# EAGLE design VSCard (EAGLE 8.3.1)
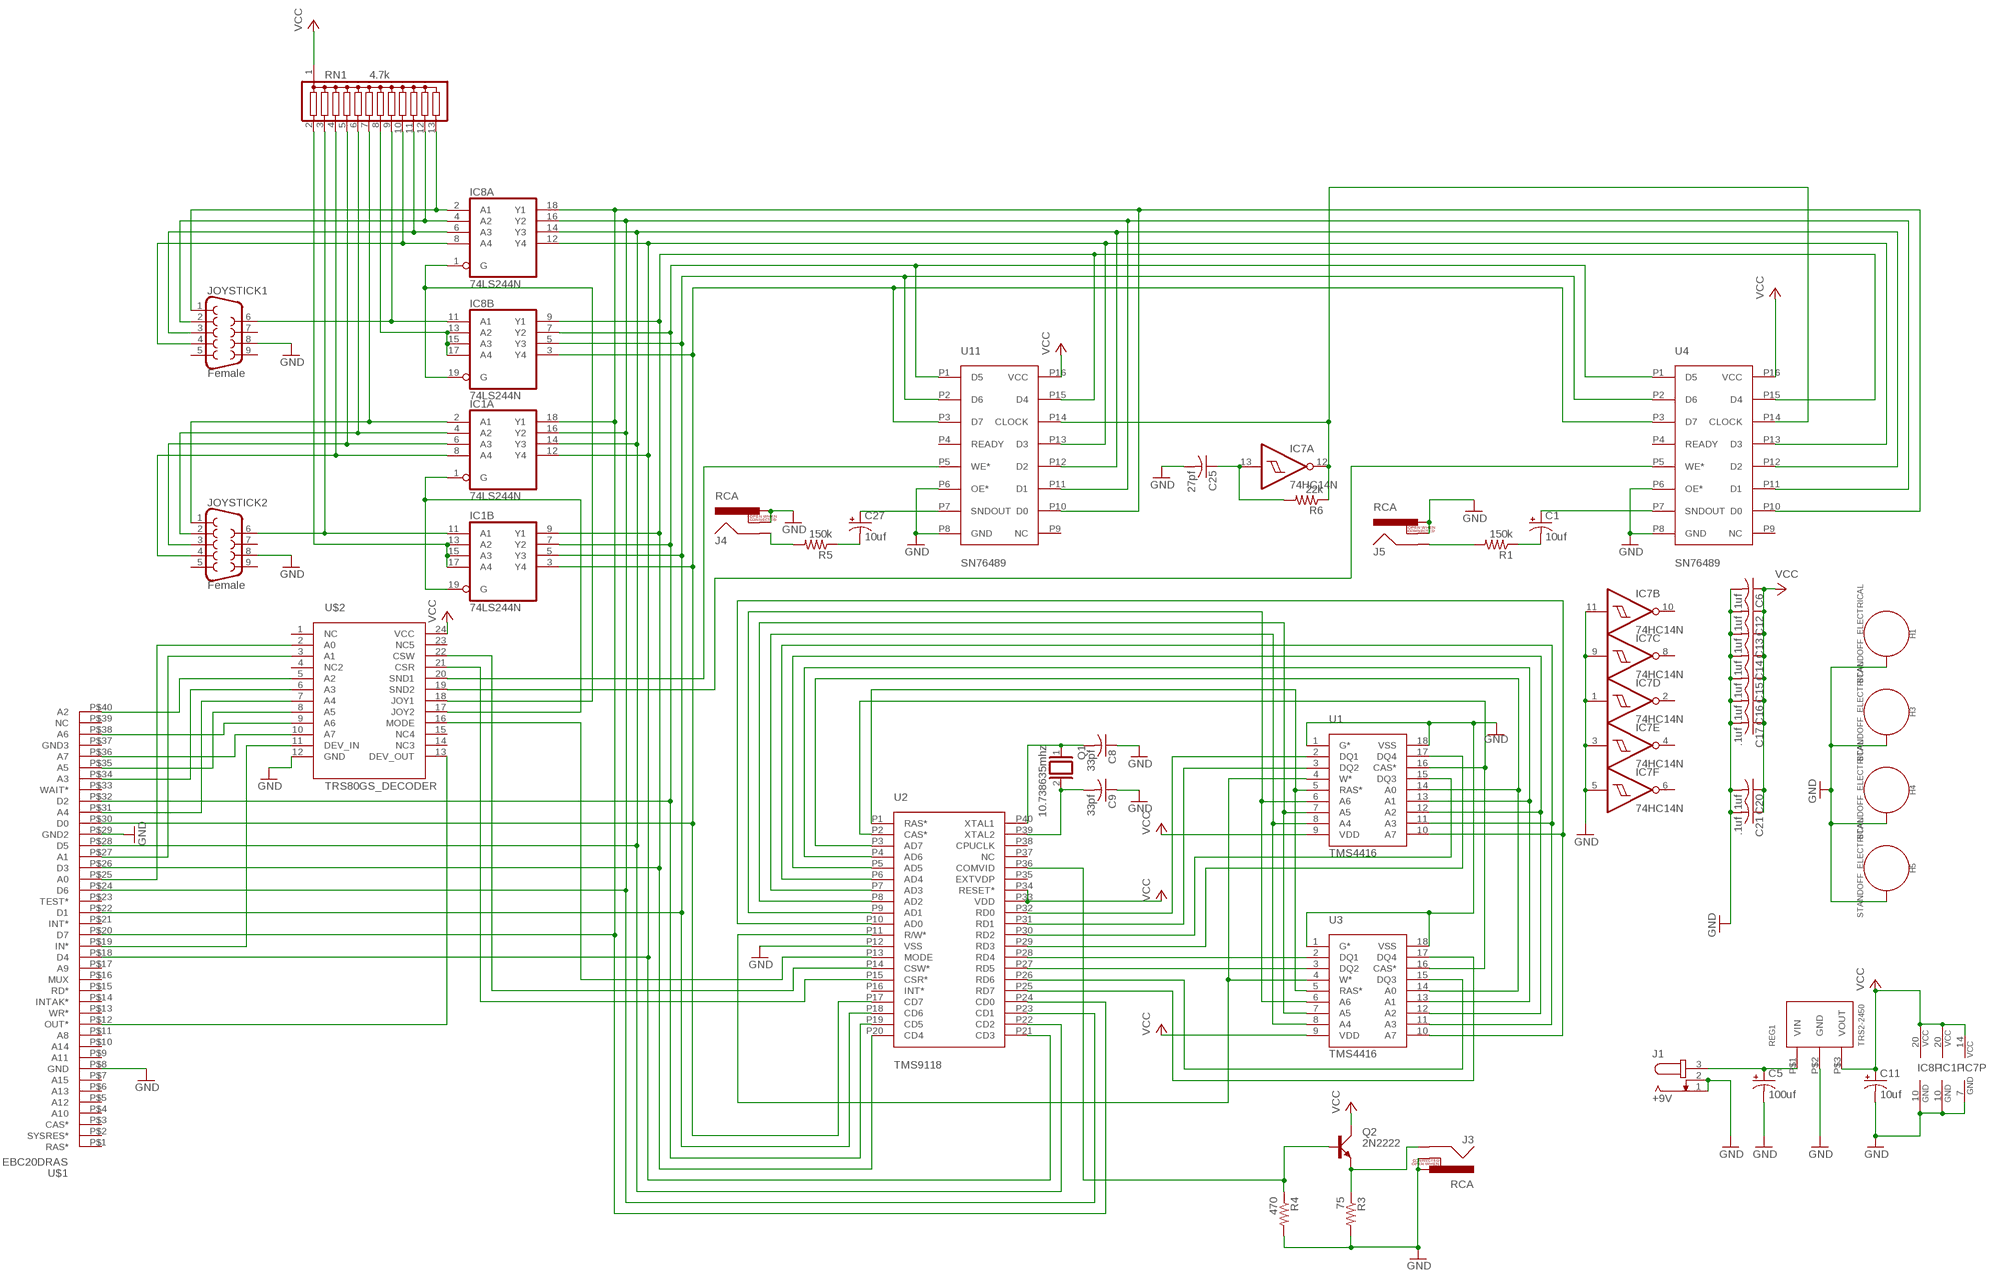
[diagram p0: schematic, sheet 1]

## Parts
C1  10uf  CPOL-USE2.5-6  [E2,5-6]
C5  100uf  CPOL-USE3.5-10  [E3,5-10]
C6  .1uf  C-US025-025X050  [C025-025X050]
C8  33pf  C-US050-050X075  [C050-050X075]
C9  33pf  C-US050-050X075  [C050-050X075]
C11  10uf  CPOL-USE3.5-10  [E3,5-10]
C12  .1uf  C-US025-025X050  [C025-025X050]
C13  .1uf  C-US025-025X050  [C025-025X050]
C14  .1uf  C-US025-025X050  [C025-025X050]
C15  .1uf  C-US025-025X050  [C025-025X050]
C16  .1uf  C-US025-025X050  [C025-025X050]
C17  .1uf  C-US025-025X050  [C025-025X050]
C20  .1uf  C-US025-025X050  [C025-025X050]
C21  .1uf  C-US025-025X050  [C025-025X050]
C25  27pf  C-US025-025X050  [C025-025X050]
C27  10uf  CPOL-USE2.5-6  [E2,5-6]
H1  STANDOFF_ELECTRICAL  [STANDOFF-ELECTRICAL]
H3  STANDOFF_ELECTRICAL  [STANDOFF-ELECTRICAL]
H4  STANDOFF_ELECTRICAL  [STANDOFF-ELECTRICAL]
H5  STANDOFF_ELECTRICAL  [STANDOFF-ELECTRICAL]
IC1  74LS244N  [DIL20]
IC7  74HC14N  [DIL14]
IC8  74LS244N  [DIL20]
J1  +9V  JACK-PLUG0  [SPC4077]
J3  RCA  [RCA]
J4  RCA  [RCA]
J5  RCA  [RCA]
JOYSTICK1  Female  DB9FEMALE  [DB9]
JOYSTICK2  Female  DB9FEMALE  [DB9]
Q1  10.738635mhz  XTAL/S  [QS]
Q2  2N2222  [TO18A]
R1  150k  R-US_0207/2V  [0207/2V]
R3  75  R-US_0207/2V  [0207/2V]
R4  470  R-US_0207/2V  [0207/2V]
R5  150k  R-US_0207/2V  [0207/2V]
R6  22k  R-US_0207/2V  [0207/2V]
REG1  TRS2-2450  [TRACON_REG]
RN1  4.7k  G12R  [SIL13]
U1  TMS4416  [DIP18]
U2  TMS9118  [DIP40_MCU]
U3  TMS4416  [DIP18]
U4  SN76489  [DIP16]
U11  SN76489  [DIP16]
U$1  EBC20DRAS  [EBC20DRAS]
U$2  TRS80GS_DECODER  [DIP24SKI]

## Nets
COMVID: Q2.B R4.1 U2.P36(COMVID)
COMVID-OUT: J3.SHELL Q2.E R3.1
D0: IC1.3(B:Y4) IC8.3(B:Y4) U2.P17(CD7) U4.P3(D7) U11.P3(D7) U$1.P$30(D0)
D1: IC1.5(B:Y3) IC8.5(B:Y3) U2.P18(CD6) U4.P2(D6) U11.P2(D6) U$1.P$22(D1)
D2: IC1.7(B:Y2) IC8.7(B:Y2) U2.P19(CD5) U4.P1(D5) U11.P1(D5) U$1.P$32(D2)
D3: IC1.9(B:Y1) IC8.9(B:Y1) U2.P20(CD4) U4.P15(D4) U11.P15(D4) U$1.P$26(D3)
D4: IC1.12(A:Y4) IC8.12(A:Y4) U2.P21(CD3) U4.P13(D3) U11.P13(D3) U$1.P$18(D4)
D5: IC1.14(A:Y3) IC8.14(A:Y3) U2.P22(CD2) U4.P12(D2) U11.P12(D2) U$1.P$28(D5)
D6: IC1.16(A:Y2) IC8.16(A:Y2) U2.P23(CD1) U4.P11(D1) U11.P11(D1) U$1.P$24(D6)
D7: IC1.18(A:Y1) IC8.18(A:Y1) U2.P24(CD0) U4.P10(D0) U11.P10(D0) U$1.P$20(D7)
DOWN: IC8.4(A:A2) JOYSTICK1.2 RN1.12
DOWN1: IC1.4(A:A2) JOYSTICK2.2 RN1.6
GND: C5.- C6.2 C8.1 C9.1 C11.- C12.2 C13.2 C14.2 C15.2 C16.2 C17.2 C20.2 C21.2 C25.2 H1.P1 H3.P1 H4.P1 H5.P1 IC1.10(P:GND) IC7.1(D:I) IC7.3(E:I) IC7.5(F:I) IC7.7(P:GND) IC7.9(C:I) IC7.11(B:I) IC8.10(P:GND) J1.1 J1.2 J3.PIN J3.SWITCH J4.PIN J4.SWITCH J5.PIN J5.SWITCH JOYSTICK1.8 JOYSTICK2.8 R3.2 R4.2 REG1.P$2(GND) U1.1(G*) U1.18(VSS) U2.P12(VSS) U3.1(G*) U3.18(VSS) U4.P6(OE*) U4.P8(GND) U11.P6(OE*) U11.P8(GND) U$1.P$8(GND) U$1.P$29(GND2) U$2.12(GND)
JOY1_IN_ENABLE_N: IC8.1(A:G) IC8.19(B:G) U$2.18(JOY1)
JOY1_IN_ENABLE_N1: IC1.1(A:G) IC1.19(B:G) U$2.17(JOY2)
LEFT: IC8.6(A:A3) JOYSTICK1.3 RN1.11
LEFT1: IC1.6(A:A3) JOYSTICK2.3 RN1.5
N$1: J4.SHELL R5.2
N$2: U$1.P$25(A0) U$2.2(A0)
N$3: U$1.P$27(A1) U$2.3(A1)
N$4: U$1.P$40(A2) U$2.5(A2)
N$5: U$1.P$34(A3) U$2.6(A3)
N$6: U$1.P$31(A4) U$2.7(A4)
N$7: U$1.P$35(A5) U$2.8(A5)
N$8: U$1.P$38(A6) U$2.9(A6)
N$9: U$1.P$36(A7) U$2.10(A7)
N$10: U$1.P$19(IN*) U$2.11(DEV_IN)
N$11: IC1.13(B:A2) IC1.15(B:A3) IC1.17(B:A4) RN1.2
N$12: U$1.P$12(OUT*) U$2.13(DEV_OUT)
N$13: U2.P13(MODE) U$2.16(MODE)
N$14: U2.P14(CSW*) U$2.22(CSW)
N$15: U2.P15(CSR*) U$2.21(CSR)
N$18: U1.5(RAS*) U2.P1(RAS*) U3.5(RAS*)
N$20: U11.P5(WE*) U$2.20(SND1)
N$21: U1.16(CAS*) U2.P2(CAS*) U3.16(CAS*)
N$22: U4.P5(WE*) U$2.19(SND2)
N$64: C27.- R5.1
N$88: C25.1 IC7.13(A:I) R6.2
N$94: C1.- R1.1
N$95: J5.SHELL R1.2
N$99: IC8.13(B:A2) IC8.15(B:A3) IC8.17(B:A4) RN1.8
RIGHT: IC8.8(A:A4) JOYSTICK1.4 RN1.10
RIGHT1: IC1.8(A:A4) JOYSTICK2.4 RN1.4
SN76489-CLOCK: IC7.12(A:O) R6.1 U4.P14(CLOCK) U11.P14(CLOCK)
SNDOUT1: C27.+ U11.P7(SNDOUT)
SNDOUT2: C1.+ U4.P7(SNDOUT)
TMS9118_RW(*)_TMS4416_W(*): U1.4(W*) U2.P11(R/W*) U3.4(W*)
TMS9918_AD0-TMS4416_A7: U1.10(A7) U2.P10(AD0) U3.10(A7)
TMS9918_AD1-TMS4416_A6: U1.6(A6) U2.P9(AD1) U3.6(A6)
TMS9918_AD2-TMS4416_A5: U1.7(A5) U2.P8(AD2) U3.7(A5)
TMS9918_AD3-TMS4416_A4: U1.8(A4) U2.P7(AD3) U3.8(A4)
TMS9918_AD4-TMS4416_A3: U1.11(A3) U2.P6(AD4) U3.11(A3)
TMS9918_AD5-TMS4416_A2: U1.12(A2) U2.P5(AD5) U3.12(A2)
TMS9918_AD6-TMS4416_A1: U1.13(A1) U2.P4(AD6) U3.13(A1)
TMS9918_AD7-TMS4416_A0: U1.14(A0) U2.P3(AD7) U3.14(A0)
TRIGGER: IC8.11(B:A1) JOYSTICK1.6 RN1.9
TRIGGER1: IC1.11(B:A1) JOYSTICK2.6 RN1.3
UP: IC8.2(A:A1) JOYSTICK1.1 RN1.13
UP1: IC1.2(A:A1) JOYSTICK2.1 RN1.7
VCC: C6.1 C11.+ C12.1 C13.1 C14.1 C15.1 C16.1 C17.1 C20.1 C21.1 IC1.20(P:VCC) IC7.14(P:VCC) IC8.20(P:VCC) Q2.C REG1.P$3(VOUT) RN1.1 U1.9(VDD) U2.P33(VDD) U2.P34(RESET*) U3.9(VDD) U4.P16(VCC) U11.P16(VCC) U$2.24(VCC)
VDP-RD0: U1.2(DQ1) U2.P32(RD0)
VDP-RD1: U1.3(DQ2) U2.P31(RD1)
VDP-RD2: U1.15(DQ3) U2.P30(RD2)
VDP-RD3: U1.17(DQ4) U2.P29(RD3)
VDP-RD4: U2.P28(RD4) U3.2(DQ1)
VDP-RD5: U2.P27(RD5) U3.3(DQ2)
VDP-RD6: U2.P26(RD6) U3.15(DQ3)
VDP-RD7: U2.P25(RD7) U3.17(DQ4)
VOLTAGE-IN: C5.+ J1.3 REG1.P$1(VIN)
XTAL1: C8.2 Q1.1 U2.P40(XTAL1)
XTAL2: C9.2 Q1.2 U2.P39(XTAL2)
Unconnected: IC7.2(D:O) IC7.4(E:O) IC7.6(F:O) IC7.8(C:O) IC7.10(B:O) JOYSTICK1.5 JOYSTICK1.7 JOYSTICK1.9 JOYSTICK2.5 JOYSTICK2.7 JOYSTICK2.9 U2.P16(INT*) U2.P35(EXTVDP) U2.P37(NC) U2.P38(CPUCLK) U4.P4(READY) U4.P9(NC) U11.P4(READY) U11.P9(NC) U$1.P$1(RAS*) U$1.P$2(SYSRES*) U$1.P$3(CAS*) U$1.P$4(A10) U$1.P$5(A12) U$1.P$6(A13) U$1.P$7(A15) U$1.P$9(A11) U$1.P$10(A14) U$1.P$11(A8) U$1.P$13(WR*) U$1.P$14(INTAK*) U$1.P$15(RD*) U$1.P$16(MUX) U$1.P$17(A9) U$1.P$21(INT*) U$1.P$23(TEST*) U$1.P$33(WAIT*) U$1.P$37(GND3) U$1.P$39(NC) U$2.1(NC) U$2.4(NC2) U$2.14(NC3) U$2.15(NC4) U$2.23(NC5)

## Library data of the parts
C1 C27 = resistor:CPOL-US: POLARIZED CAPACITOR, American symbol
C5 C11 = rcl:CPOL-US: POLARIZED CAPACITOR, American symbol
C6 C12-C17 C20 C21 C25 = resistor:C-US: CAPACITOR, American symbol
C8 C9 = rcl:C-US: CAPACITOR, American symbol
H1 H3-H5 = SparkFun-Hardware:STANDOFF_ELECTRICAL: Stand Off Drill holes with an electrical connection. For example, use these to ground your board to a chassis. Example SparkFun Products Screw - Phillips Head (1/4", 4-40, 10 pack) <https://www.sparkfun.com/products/10453> (PRT-10453) Screw - Phillips Head (1/2", 4-40, 10 pack) <https://www.sparkfun.com/products/10452> (PRT-10452) Screw - Phillips Head (3/4", 4-40, 10 pack) <https://www.sparkfun.com/products/10451> (PRT-10451) Screw - Phillips Head (1", 4-40, 10 pack) <https://www.sparkfun.com/products/10450> (PRT-10450)
IC1 IC8 = 74xx-us:74*244: Octal BUFFER and LINE DRIVER, 3-state
IC7 = 74xx-eu:74*14: Hex schmitt trigger INVERTER
J1 = con-jack:JACK-PLUG: DC POWER JACK Power Jack, DC, Right Angle, Through Hole, Rated 5A at 16VDC, PC Terminals Distributor: Farnell (www.Farnell.de) Drawing: 84N1161.pdf / 84N1162.pdf Manufacturer: SPC Technology (www.spctechnology.com) Type: SPC4077 / SPC 4078; OC_FARNELL: unknown; OC_NEWARK: unknown
J3-J5 = SparkFun-Connectors:RCA: RCA Jack connector This is a right angle RCA jack connecotr. Commonly used for video or audio. Here is the connector we sell at SparkFun: RCA Jack <https://www.sparkfun.com/products/8631> (PRT-08631) Datasheet <http://www.sparkfun.com/datasheets/Prototyping/Connectors/RCA-Jack.pdf> It is not used on any active designs, however it was used on a couple retired products: RCA Jack Breakout [RETIRED] <https://www.sparkfun.com/products/8826> (PRT-08826) SparkFun On Screen Display Breakout - MAX7456 [RETIRED] <https://www.sparkfun.com/products/9168> (BOB-09168) You may also be interested in a cable: RCA Video Cable - 6' <https://www.sparkfun.com/products/11573> (CAB-11573); PROD_ID: CONN-09081; SF_ID: PRT-08631
JOYSTICK1 JOYSTICK2 = SparkFun-Connectors:DB9: DB9 Connector Standard DB9 (D-Sub 9) serial connector. Can be used for CAN bus as well as RS485 and RS232. Footprint production proven. Here is the female version connector we sell at SparkFun: 9 Pin Female Serial Connector - PCB Mount <https://www.sparkfun.com/products/429> (PRT-00429) This connector has been used on the following SparkFun products: SparkFun RS232 Shifter - SMD <https://www.sparkfun.com/products/449> (PRT-00449) SparkFun RS232 Shifter SMD (No DB9) <https://www.sparkfun.com/products/8780> (PRT-08780); PROD_ID: CONN-08194
Q1 = special:XTAL/S: CRYSTAL
Q2 = transistor-small-signal:2N2222: NPN TRANSISTOR
R1 R3-R6 = resistor:R-US_: RESISTOR, American symbol
REG1 = TMS99:TRS2-2450: 5V TRACO regulator
RN1 = resistor-sil:G12R: SIL RESISTOR; OC_FARNELL: unknown; OC_NEWARK: unknown
U1 U3 = TMS99:TMS4416: TMS4416
U2 = TMS99:TMS9118: TMS9118
U4 U11 = TMS99:SN76489: SN76489 Sound Chip
U$1 = TMS99:EBC20DRAS
U$2 = TMS99:TRS80GS_DECODER

## Board
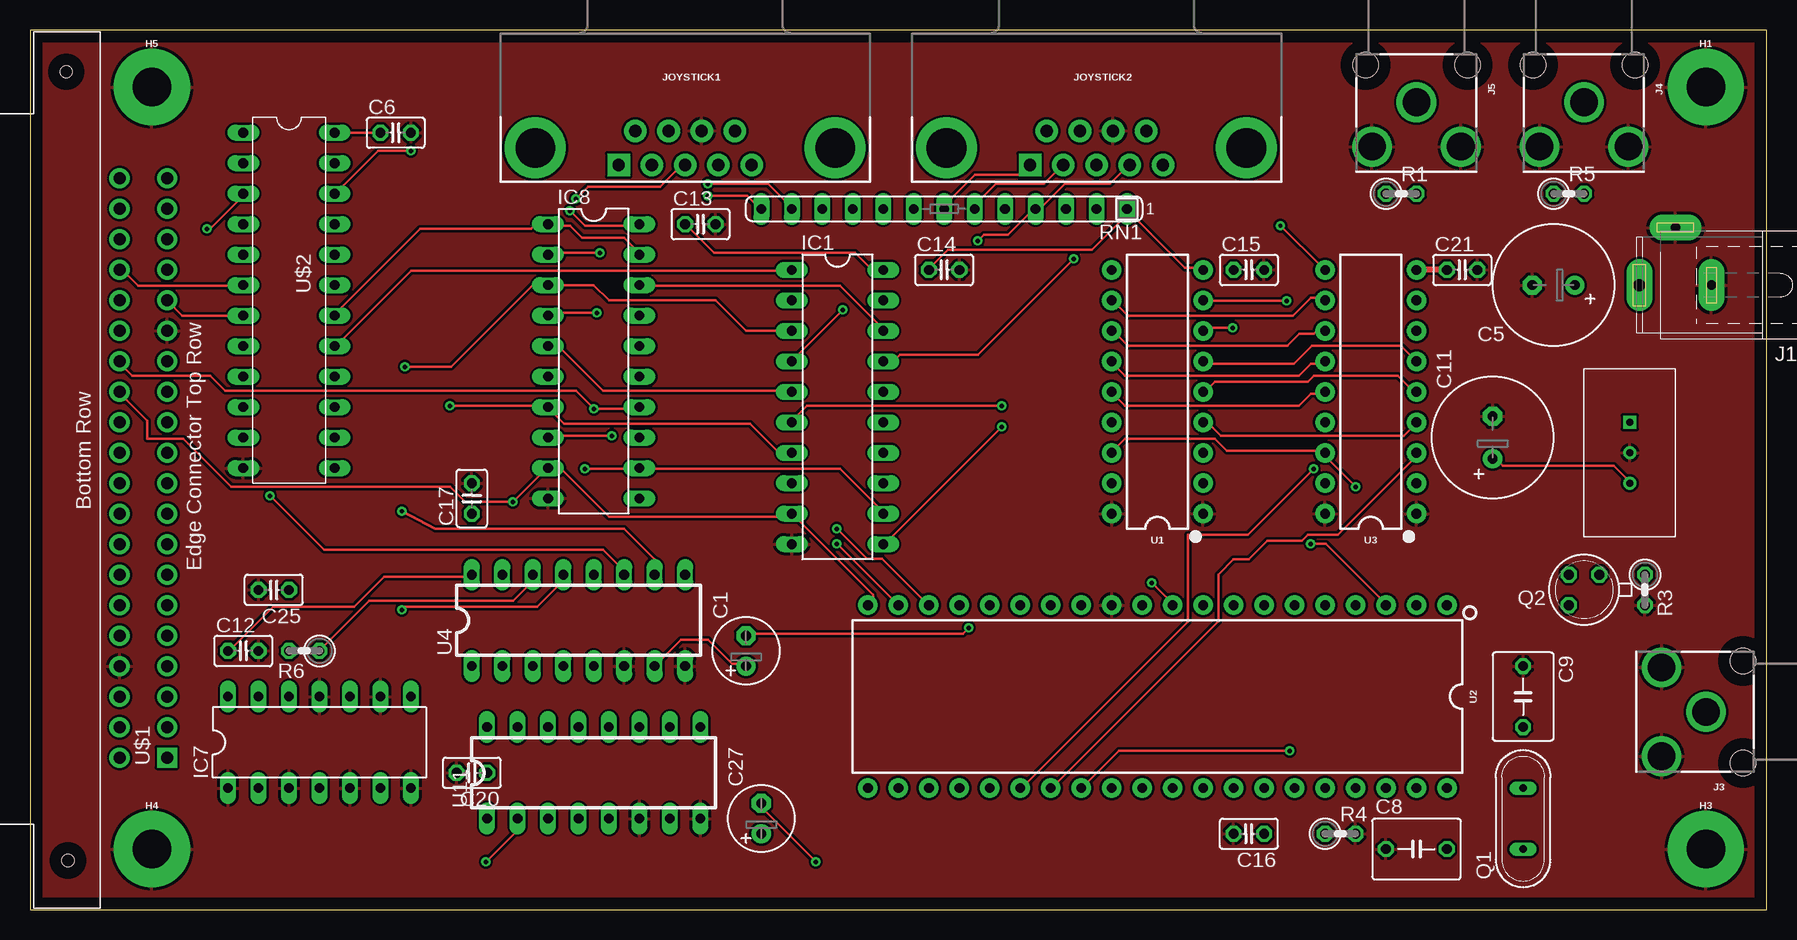
[diagram p1: board, top side]
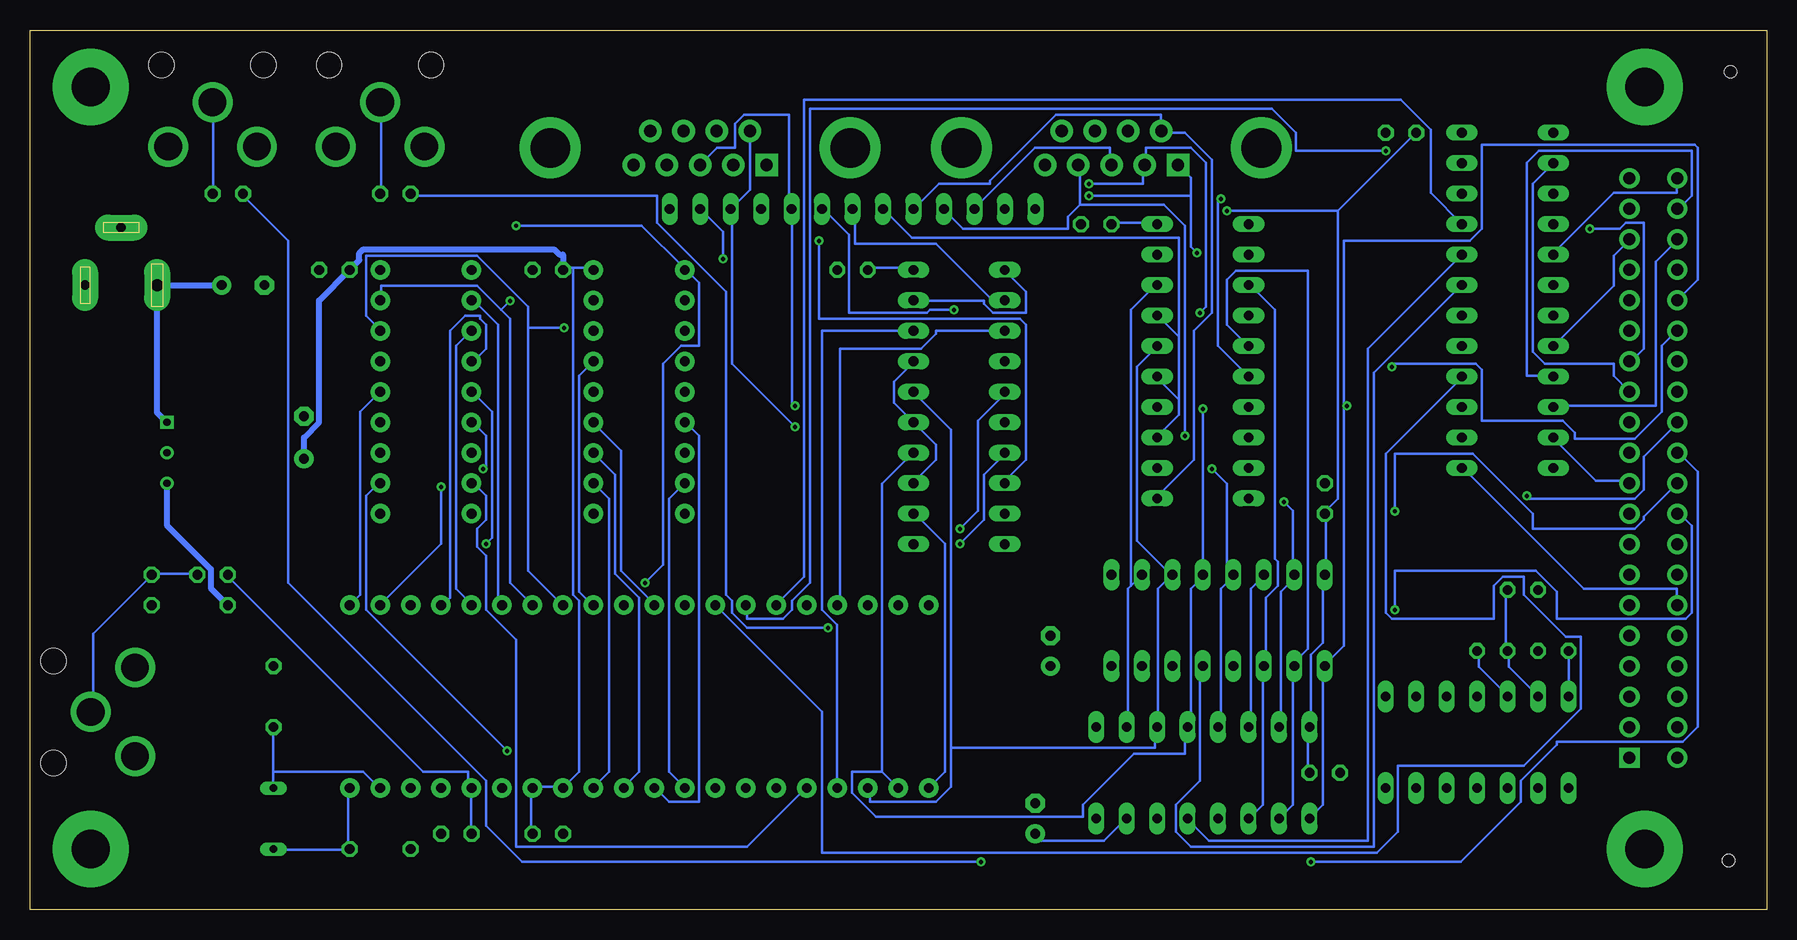
[diagram p2: board, bottom side, seen from below]

Size 144.76 x 73.33 mm. Coordinates in mm from the lower left corner, seen from the top.
Outline: 0,0 144.76,0 144.76,73.33 0,73.33 0,0
Copper layers (1*16): Top 0.035mm / dielectric 1.5mm / Bottom 0.035mm
Design rules "default": minimum track width 0.2mm, minimum drill 0.35mm, track to track 8mil, track to pad 8mil, pad to pad 8mil, via to via 8mil, smd to smd 8mil, copper to edge 40mil, drill to drill 6mil, minimum pad ring 10mil, minimum via ring 8mil, stop-mask expansion 4mil, vias tented up to drill 0mil, thermal gap 10mil

### Footprints (pad centres in the part's own frame; a part is rotated, then mirrored left to right if it is on the bottom)
E2,5-6 = drill 0.813 pad 1.6: + -1.27,0 | drill 0.813 pad 1.6 octagon: - 1.27,0
E3,5-10 = drill 0.813 pad 1.6: + -1.778,0 | drill 0.813 pad 1.6 octagon: - 1.778,0
C025-025X050 = drill 0.813 octagon: 1 -1.27,0; 2 1.27,0
C050-050X075 = drill 0.813 octagon: 1 -2.54,0; 2 2.54,0
STANDOFF-ELECTRICAL = drill 3.2 pad 6.35: P1 0,0
DIL20 = drill 0.813 long: 1 -11.43,-3.81; 2 -8.89,-3.81; 3 -6.35,-3.81; 4 -3.81,-3.81; 5 -1.27,-3.81; 6 1.27,-3.81; 7 3.81,-3.81; 8 6.35,-3.81; 9 8.89,-3.81; 10 11.43,-3.81; 11 11.43,3.81; 12 8.89,3.81; 13 6.35,3.81; 14 3.81,3.81; 15 1.27,3.81; 16 -1.27,3.81; 17 -3.81,3.81; 18 -6.35,3.81; 19 -8.89,3.81; 20 -11.43,3.81
DIL14 = drill 0.813 long: 1 -7.62,-3.81; 2 -5.08,-3.81; 3 -2.54,-3.81; 4 0,-3.81; 5 2.54,-3.81; 6 5.08,-3.81; 7 7.62,-3.81; 8 7.62,3.81; 9 5.08,3.81; 10 2.54,3.81; 11 0,3.81; 12 -2.54,3.81; 13 -5.08,3.81; 14 -7.62,3.81
SPC4077 = drill 0.8 pad 2.184 long: 1 -3,0; 2 0,-4.8 | drill 1 pad 2.184 long: 3 3,0
RCA = drill 2.3: PIN 3.7,3.7; SHELL 0,0; SWITCH 3.7,-3.7 | hole 2.1: -3.1,4.25; -3.1,-4.25
DB9 = drill 1.016 pad 1.88 square: 1 -5.54,-1.42 | drill 1.016 pad 1.88: 2 -2.77,-1.42; 3 0,-1.42; 4 2.77,-1.42; 5 5.54,-1.42; 6 -4.15,1.42; 7 -1.38,1.42; 8 1.38,1.42; 9 4.15,1.42 | drill 3.302 pad 5.08: G1 -12.5,0; G2 12.5,0
QS = drill 0.61 long: 1 -2.54,0; 2 2.54,0
TO18A = drill 0.813 octagon: B 1.27,-1.27; C 1.27,1.27; E -1.27,-1.27
0207/2V = drill 0.813 octagon: 1 -1.27,0; 2 1.27,0
TRACON_REG = drill 0.6 square: P$1 0,0 | drill 0.6: P$2 2.54,0; P$3 5.08,0
SIL13 = drill 0.813 long: 1 -15.24,0; 2 -12.7,0; 3 -10.16,0; 4 -7.62,0; 5 -5.08,0; 6 -2.54,0; 7 0,0; 8 2.54,0; 9 5.08,0; 10 7.62,0; 11 10.16,0; 12 12.7,0; 13 15.24,0
DIP18 = drill 0.813 pad 1.626: 1 -10.16,-3.81; 2 -7.62,-3.81; 3 -5.08,-3.81; 4 -2.54,-3.81; 5 0,-3.81; 6 2.54,-3.81; 7 5.08,-3.81; 8 7.62,-3.81; 9 10.16,-3.81; 10 10.16,3.81; 11 7.62,3.81; 12 5.08,3.81; 13 2.54,3.81; 14 0,3.81; 15 -2.54,3.81; 16 -5.08,3.81; 17 -7.62,3.81; 18 -10.16,3.81
DIP40_MCU = drill 0.813 pad 1.626: P1 -24.13,-7.62; P2 -21.59,-7.62; P3 -19.05,-7.62; P4 -16.51,-7.62; P5 -13.97,-7.62; P6 -11.43,-7.62; P7 -8.89,-7.62; P8 -6.35,-7.62; P9 -3.81,-7.62; P10 -1.27,-7.62; P11 1.27,-7.62; P12 3.81,-7.62; P13 6.35,-7.62; P14 8.89,-7.62; P15 11.43,-7.62; P16 13.97,-7.62; P17 16.51,-7.62; P18 19.05,-7.62; P19 21.59,-7.62; P20 24.13,-7.62; P21 24.13,7.62; P22 21.59,7.62; P23 19.05,7.62; P24 16.51,7.62; P25 13.97,7.62; P26 11.43,7.62; P27 8.89,7.62; P28 6.35,7.62; P29 3.81,7.62; P30 1.27,7.62; P31 -1.27,7.62; P32 -3.81,7.62; P33 -6.35,7.62; P34 -8.89,7.62; P35 -11.43,7.62; P36 -13.97,7.62; P37 -16.51,7.62; P38 -19.05,7.62; P39 -21.59,7.62; P40 -24.13,7.62
DIP16 = drill 0.813 long: P1 -8.89,-3.81; P2 -6.35,-3.81; P3 -3.81,-3.81; P4 -1.27,-3.81; P5 1.27,-3.81; P6 3.81,-3.81; P7 6.35,-3.81; P8 8.89,-3.81; P9 8.89,3.81; P10 6.35,3.81; P11 3.81,3.81; P12 1.27,3.81; P13 -1.27,3.81; P14 -3.81,3.81; P15 -6.35,3.81; P16 -8.89,3.81
EBC20DRAS = drill 1 pad 1.676 square: P$1 0,0 | drill 1 pad 1.676: P$2 0,3.969; P$3 2.54,0; P$4 2.54,3.969; P$5 5.08,0; P$6 5.08,3.969; P$7 7.62,0; P$8 7.62,3.969; P$9 10.16,0; P$10 10.16,3.969; P$11 12.7,0; P$12 12.7,3.969; P$13 15.24,0; P$14 15.24,3.969; P$15 17.78,0; P$16 17.78,3.969; P$17 20.32,0; P$18 20.32,3.969; P$19 22.86,0; P$20 22.86,3.969; P$21 25.4,0; P$22 25.4,3.969; P$23 27.94,0; P$24 27.94,3.969; P$25 30.48,0; P$26 30.48,3.969; P$27 33.02,0; P$28 33.02,3.969; P$29 35.56,0; P$30 35.56,3.969; P$31 38.1,0; P$32 38.1,3.969; P$33 40.64,0; P$34 40.64,3.969; P$35 43.18,0; P$36 43.18,3.969; P$37 45.72,0; P$38 45.72,3.969; P$39 48.26,0; P$40 48.26,3.969 | hole 1: -8.572,8.255; 57.15,8.414
DIP24SKI = drill 0.813 pad 1.27 long: 1 -11.43,-3.81; 2 -8.89,-3.81; 3 -6.35,-3.81; 4 -3.81,-3.81; 5 -1.27,-3.81; 6 1.27,-3.81; 7 3.81,-3.81; 8 6.35,-3.81; 9 8.89,-3.81; 10 11.43,-3.81; 11 13.97,-3.81; 12 16.51,-3.81; 13 16.51,3.81; 14 13.97,3.81; 15 11.43,3.81; 16 8.89,3.81; 17 6.35,3.81; 18 3.81,3.81; 19 1.27,3.81; 20 -1.27,3.81; 21 -3.81,3.81; 22 -6.35,3.81; 23 -8.89,3.81; 24 -11.43,3.81

### Placement (x,y rotation side)
C1  59.69,21.59 90 top
C5  127,52.07 180 top
C6  30.48,64.77 0 top
C8  115.57,5.08 0 top
C9  124.46,17.78 270 top
C11  121.92,39.37 90 top
C12  17.78,21.59 0 top
C13  55.88,57.15 0 top
C14  76.2,53.34 0 top
C15  101.6,53.34 0 top
C16  101.6,6.35 180 top
C17  36.83,34.29 90 top
C20  36.83,11.43 180 top
C21  119.38,53.34 0 top
C25  20.32,26.67 180 top
C27  60.96,7.62 90 top
H1  139.7,68.58 0 top
H3  139.7,5.08 0 top
H4  10.16,5.08 0 top
H5  10.16,68.58 0 top
IC1  67.31,41.91 270 top
IC7  24.13,13.97 0 top
IC8  46.99,45.72 270 top
J1  137.16,52.07 180 top
J3  139.7,16.51 180 top
J4  129.54,67.31 270 top
J5  115.57,67.31 270 top
JOYSTICK1  54.61,63.5 0 top
JOYSTICK2  88.9,63.5 0 top
Q1  124.46,7.62 90 top
Q2  129.54,26.67 180 top
R1  114.3,59.69 0 top
R3  134.62,26.67 270 top
R4  109.22,6.35 0 top
R5  128.27,59.69 0 top
R6  22.86,21.59 180 top
REG1  133.35,40.64 270 top
RN1  76.2,58.42 180 top
U1  93.98,43.18 90 top
U2  93.98,17.78 180 top
U3  111.76,43.18 90 top
U4  45.72,24.13 0 top
U11  46.99,11.43 0 top
U$1  11.43,12.7 90 top
U$2  21.59,53.34 270 top

### Tracks (layer width: path | path; a pad name or v marks a point on that pad's centre or on a via)
COMVID
  Bottom 0.2: R4.1 108,6.5 108,10 U2.P36 108,10.25 108.25,10.5 108.25,11.5 112,11.5 128.25,27.75 Q2.B
COMVID-OUT
  Bottom 0.2: Q2.E 131,28 134.5,28 R3.1 134.75,27.75 139.5,23 139.5,16.75 J3.SHELL
D0  (via drill 0.35)
  Top 0.2: IC8.3 43,52.25 | 43.25,52 44.25,52 | 63.5,48.5 IC1.3 59.69,48.26 57.15,50.8 48.26,50.8 46.99,52.07 43.32,52.07 43.25,52 | 43.25,52 IC8.3 | v31.25,45.25 35.09,45.25 41.91,52.07 IC8.3
  Bottom 0.2: IC1.3 69.25,48.25 69.25,48 70.5,46.75 77.25,46.75 77.25,25.5 U2.P17 | U11.P3 43,7.75 42,8.75 42,20.25 U4.P3 41.75,20.5 41.75,26 40.75,27 40.75,29 41,29.25 41,50 43,52 IC8.3 | v31.25,45.25 31.25,45.5 24.25,45.5 23.75,45 23.75,40.75 17,40.75 16,39.75 16,39.25 11,39.25 8.75,41.5 8.75,47 7.5,48.25 U$1.P$30
  Bottom 0.508: IC1.3
D1  (via drill 0.35)
  Top 0.2: IC1.5 63.5,43.25 47.75,43.25 44.25,46.75 43.25,46.75 IC8.5 | v67.25,31.75 69.75,29.25 71,29.25 74.75,25.5 U2.P18 | v38,4 40.5,6.5 40.5,7.5 U11.P2
  Bottom 0.2: U11.P2 40.5,7.75 39.5,8.75 39.5,20.25 U4.P2 39.25,20.5 39.25,20.75 38.25,21.75 38.25,53.25 44.25,53.25 45,52.5 45,48.75 43.25,47 IC8.5 | v67.25,31.75 65.75,33.25 65.75,40.75 63.5,43 IC1.5 | v38,4 25.5,4 20.5,9 20.5,10.75 17.5,13.75 17.5,14 7,14 5.75,15.25 5.75,36.5 7.25,38 U$1.P$22
D2  (via drill 0.35)
  Top 0.2: IC1.7 63.5,38.25 62.25,38.25 60,40.5 44.5,40.5 43.25,41.75 IC8.7 43,42 v35,42 | v67.25,30.5 72.25,25.5 U2.P19
  Bottom 0.2: v67.25,30.5 65.25,32.5 65.25,36.25 63.5,38 IC1.7 | U11.P1 38,7.75 37,8.75 37,20.25 U4.P1 36.75,20.5 35.25,22 35.25,42 | 35.25,42 35.25,55.75 24.75,55.75 23.75,56.75 23.75,63.75 6,63.75 5.75,63.5 5.75,52.5 7.25,51 U$1.P$32 | 35.25,42 v35,42
D3  (via drill 0.35)
  Top 0.2: 63.5,33 70.25,26.25 70.25,25.5 70,25.5 U2.P20 | U$1.P$26 7.5,43 9.75,40.75 9.75,39.25 12.75,39.25 16.75,35.25 35,35.25 36.25,34 v40.25,34 43,36.75 IC8.9 43.25,36.75 44.25,36.75 48.25,32.75 63.25,32.75 63.5,33 | 63.5,33 IC1.9
  Bottom 0.2: U11.P15 40.5,15.25 40.5,26.5 39.5,27.5 39.5,27.75 U4.P15 39.5,28 39.5,33.25 v40.25,34
D4  (via drill 0.35)
  Top 0.2: v46.25,36.75 50.75,36.75 IC8.12 51,36.75 67.5,36.75 71,33.25 IC1.12 | v31,25 31.25,25.25 42.25,25.25 44.25,27.25 44.25,27.75 U4.P13
  Bottom 0.2: IC1.12 71,33 68.5,30.5 68.5,11.5 69.75,10.25 U2.P21 | 45,27.25 45.5,26.75 45.5,15.25 U11.P13 | 45,27.25 44.5,27.75 U4.P13 45,27.25 | v46.25,36.75 45,35.5 45,27.25 | v31,25 31,28.25 19.25,28.25 17.5,26.5 17.5,24.25 6.75,24.25 6.25,24.75 6.25,32 7.25,33 U$1.P$18
D5  (via drill 0.35)
  Top 0.2: IC8.14 50.75,41.75 v47,41.75 45.5,43.25 16.25,43.25 15,44.5 8.5,44.5 7.5,45.5 U$1.P$28
  Bottom 0.2: 73.75,11.5 73.75,35.5 71.25,38 IC1.14 | 73.75,11.5 72.5,10.25 U2.P22 | v47,41.75 47,28 U4.P12 47,27.75 48,26.75 48,15.5 U11.P12 48.5,15 48.5,13 52.75,13 57,8.75 57,7.75 74.25,7.75 76.25,9.75 76.25,11.5 73.75,11.5
D6  (via drill 0.35)
  Top 0.2: v20,34.5 24.5,30 47.75,30 49.75,28 U4.P11
  Bottom 0.2: 68,13.5 68,10.25 69.25,9 74.75,9 74.75,10 U2.P23 | 68,13.5 68,40 71,43 IC1.16 | IC8.16 51,46.75 52.5,45.25 52.5,30.75 49.75,28 U4.P11 49.75,27.75 50.75,26.75 50.75,15.25 U11.P11 51,15 51,13.5 68,13.5 | v20,34.5 20,34.25 11,34.25 10.25,35 10.25,37.75 7.5,40.5 U$1.P$24
D7  (via drill 0.35)
  Top 0.2: v31,33.23 33.75,31.75 49.53,31.75 52.07,29.21 U4.P10 52.25,28 | IC1.18 71,48.5 67.5,52 51,52 IC8.18
  Bottom 0.2: IC1.18 71.25,48.25 78.75,48.25 78.75,25 77.5,23.75 77.5,10.25 U2.P24 | 53,27 52.25,27.75 U4.P10 | 53,27 53.25,26.75 53.25,15.25 U11.P10 | 53,27 53,50 51,52 IC8.18 | v31,33.23 31,38 24.5,38 19.5,33 19.5,31.75 11,31.75 10.25,32.5 10.25,32.75 7.5,35.5 U$1.P$20
DOWN  (via drill 0.35)
  Top 0.2: v47.25,49.75 43.25,49.75 IC8.4 | v56.5,60.5 61.5,60.5 63.5,58.5 RN1.12
  Bottom 0.2: v47.25,49.75 46.75,50.25 46.75,62.25 48,63.5 51.75,63.5 51.75,62.25 JOYSTICK1.2 52,62 52,60.5 v56.5,60.5
DOWN1  (via drill 0.35)
  Top 0.2: v67.75,50 63.5,45.75 IC1.4 | JOYSTICK2.2 86,62 84.5,60.5 80.5,60.5 78.5,58.5 RN1.6
  Bottom 0.2: v67.75,50 69.75,50 70,49.75 76.5,49.75 76.5,56.25 78.5,58.25 RN1.6
GND
  pour Top: 0,0 154.94,0 154.94,73.66 0,73.66
JOY1_IN_ENABLE_N
  Top 0.2: U$2.18 25.5,49.75 32.5,56.75 41.75,56.75 42,57 43,57 IC8.1 43.25,57 45,57 46,56 49.5,56 50.75,54.75 IC8.19
JOY1_IN_ENABLE_N1
  Top 0.2: U$2.17 25.5,47 31.75,53.25 63.5,53.25 IC1.1
  Bottom 0.2: IC1.19 71,50.75 65.25,50.75 65.25,50.5 64.5,49.75 61.75,49.75 61.75,51.5 63.5,53.25 IC1.1
LEFT  (via drill 0.35)
  Top 0.2: v45.5,59.25 46.5,60.25 52.5,60.25 54.25,62 54.5,62 JOYSTICK1.3
  Bottom 0.2: v45.5,59.25 45.75,59 45.75,47 43.25,44.5 IC8.6 | RN1.11 66,58.5 61,63.5 54.75,63.5 54.75,62.25 JOYSTICK1.3
LEFT1  (via drill 0.35)
  Top 0.2: v81,42 64.75,42 63.5,40.75 IC1.6
  Bottom 0.2: v81,42 81.25,42.25 81.25,58.25 RN1.5 81.5,58.5 81.5,66.25 85.25,66.25 86,65.5 86,63.5 87.5,63.5 88.75,62.25 JOYSTICK2.3
N$1
  Bottom 0.2: R5.2 129.5,59.75 129.5,67.25 J4.SHELL
N$2
  Bottom 0.2: U$1.P$25 12.75,44.5 12.75,45.5 18.5,45.5 19.5,46.5 19.5,60.5 18,62 U$2.2
N$3  (via drill 0.35)
  Top 0.2: v14.75,56.75 15,56.75 17.75,59.5 U$2.3
  Bottom 0.2: v14.75,56.75 12.25,56.75 11.75,57.25 10.25,57.25 10.25,46.75 11.25,45.75 U$1.P$27
N$4
  Bottom 0.2: U$2.5 17.75,54.75 12.75,59.75 7.5,59.75 7.5,60.75 U$1.P$40
N$5
  Top 0.2: U$2.6 17.75,52 9,52 7.75,53.25 7.5,53.25 U$1.P$34
N$6
  Top 0.2: U$1.P$31 12.7,49.53 U$2.7
N$7
  Bottom 0.2: U$2.8 17.75,47 12.75,52 12.75,54.5 11.5,55.75 U$1.P$35
N$8
  Bottom 0.2: U$2.9 18,44.5 20,44.5 20,62.25 19,63.25 6.25,63.25 6.25,59.5 7.25,58.5 U$1.P$38
N$9
  Bottom 0.2: U$2.10 17.75,42 9.25,42 9.25,54 7.5,55.75 U$1.P$36
N$10
  Bottom 0.2: U$2.11 17.75,39.25 14.25,35.75 11.5,35.75 U$1.P$19
N$11  (via drill 0.35)
  Top 0.2: v87,54.25 79,46.25 72.5,46.25 72,45.75 71.25,45.75 IC1.17
  Bottom 0.2: IC1.13 71,35.75 69.25,37.5 69.25,38.75 71,40.5 IC1.15 71.25,40.75 72.75,42.25 72.75,44 71.25,45.5 IC1.17 | v87,54.25 87,56.5 88.75,58.25 RN1.2
N$12
  Bottom 0.2: U$2.13 25.25,36.75 15.25,26.75 7.5,26.75 7.5,25.5 U$1.P$12
N$13
  Bottom 0.2: U$2.16 25.5,44.25 31.75,38 31.75,24.75 31.25,24.25 22.75,24.25 22.75,27 22,27.75 20.25,27.75 20.25,26.25 16.75,22.75 15.5,22.75 15.5,16.75 20.25,12 30.75,12 30.75,6.5 32.5,4.75 78.75,4.75 78.75,16.5 87.5,25.25 U2.P13
N$14  (via drill 0.35)
  Top 0.2: v31.75,63.25 29,63.25 25.5,59.75 U$2.22
  Bottom 0.2: v31.75,63.25 39.25,63.25 39.25,64.75 41.25,66.75 79.75,66.75 79.75,27.25 81.25,25.75 81.25,25 82,24.25 85,24.25 85,25.25 U2.P14
N$15
  Bottom 0.2: U$2.21 28,59.75 28,65 30.5,67.5 80.25,67.5 80.25,27.75 82.5,25.5 U2.P15
N$18
  Top 0.2: U1.5 98,43.25 98.75,44 106.5,44 107,44.5 114,44.5 115.25,43.25 115.5,43.25 U3.5
  Bottom 0.2: U3.5 117.25,41.5 117.25,26.25 118,25.5 U2.P1
N$20
  Bottom 0.2: U11.P5 48.25,7.5 46.5,5.75 33.25,5.75 33.25,46.75 25.5,54.5 U$2.20
N$21  (via drill 0.35)
  Top 0.2: U1.16 90.25,38.25 91.25,39.25 98.75,39.25 99.75,38.25 107.75,38.25 U3.16 107.75,38 v110.5,35.25
  Bottom 0.2: v110.5,35.25 110.5,30.5 115.5,25.5 U2.P2
N$22
  Bottom 0.2: U4.P5 47,20.25 47.25,20 47.25,10.75 49.25,8.75 49.25,6.5 48,5.25 32.75,5.25 32.75,44.75 25.5,52 U$2.19
N$64  (via drill 0.35)
  Top 0.2: v65.5,4 60.75,8.75 C27.-
  Bottom 0.2: v65.5,4 103.75,4 106.75,7 106.75,10.75 123.25,27.25 123.25,55.75 127,59.5 R5.1
N$88
  Bottom 0.2: IC7.13 19.25,18 21.5,20.25 21.5,21.5 R6.2 21.75,21.75 21.75,26.5 C25.1
N$94  (via drill 0.35)
  Top 0.2: v78.25,23.5 77.75,23 59.75,23 C1.-
  Bottom 0.2: v78.25,23.5 85,23.5 86.25,24.75 86.25,25.75 86.75,26.25 86.75,51.5 92.5,57.25 92.5,59.5 113,59.5 R1.1
N$95
  Bottom 0.2: R1.2 115.5,59.75 115.5,67.25 J5.SHELL
N$99
  Bottom 0.2: 49,42.5 49,41.25 50.75,39.5 IC8.13 | 49,42.5 50.75,44.25 IC8.15 | 49,47.75 50.75,49.5 IC8.17 | 49,42.5 49,47.75 | 49,47.75 49,56 71.25,56 73.5,58.25 RN1.8
RIGHT  (via drill 0.35)
  Top 0.2: v48.5,39.5 43.25,39.5 IC8.8
  Bottom 0.2: v48.5,39.5 48.5,57 50.25,58.75 57.25,58.75 | 57.25,58.75 57.25,62 JOYSTICK1.4 | 57.25,58.75 58.25,57.75 58.25,56.75 67,56.75 68.5,58.25 RN1.10
RIGHT1  (via drill 0.35)
  Top 0.2: v79,55.75 79.5,56.25 81.5,56.25 83.5,58.25 83.75,58.25 RN1.4 84,58.5 84.25,58.5 86.25,60.5 90,60.5 91.5,62 JOYSTICK2.4
  Bottom 0.2: v79,55.75 79,49.25 62.25,49.25 61.75,48.75 61.75,37.5 63.5,35.75 IC1.8
SN76489-CLOCK
  Top 0.2: R6.1 24.25,21.75 28.25,25.75 40.25,25.75 41.75,27.25 41.75,27.75 U4.P14
  Bottom 0.2: IC7.12 21.75,18 24,20.25 24,21.5 R6.1 | U11.P14 43,15.25 43,26.75 42,27.75 U4.P14
SNDOUT1
  Bottom 0.2: U11.P7 53.5,7.5 55.25,5.75 60.75,5.75 60.75,6.25 C27.+
SNDOUT2
  Top 0.2: U4.P7 54.25,22.5 56.5,22.5 58.5,20.5 59.5,20.5 C1.+
TMS9118_RW(*)_TMS4416_W(*)
  Top 0.2: U3.4 115.5,40.5 114.5,39.5 99.25,39.5 98.25,40.5 98,40.5 U1.4
  Bottom 0.2: U2.P11 92.75,25.5 95.5,28.25 95.5,38.25 97.75,40.5 U1.4
TMS9918_AD0-TMS4416_A7  (via drill 0.35)
  Top 0.2: v93.5,27.25 95.25,25.5 U2.P10 | v104.23,57.02 107.75,53.5 U3.10
  Bottom 0.2: v93.5,27.25 92,28.75 92,45.5 90.5,47 89,47 89,52.25 90,53.25 U1.10 90.25,53.5 93.77,57.02 v104.23,57.02
TMS9918_AD1-TMS4416_A6
  Top 0.2: U3.6 115.5,45.75 114.25,47 106.85,47 105.35,45.5 98,45.5 U1.6
  Bottom 0.2: U2.P9 98,25.5 99,26.5 99,44.5 98,45.5 U1.6
TMS9918_AD2-TMS4416_A5  (via drill 0.35)
  Top 0.2: v100.25,48.5 98,48.5 U1.7
  Bottom 0.2: 103.25,48.5 103.25,50.25 107.5,54.5 116.75,54.5 116.75,49.5 115.75,48.5 U3.7 | 103.25,48.5 103.25,28.25 100.5,25.5 U2.P8 | 103.25,48.5 v100.25,48.5
TMS9918_AD3-TMS4416_A4  (via drill 0.35)
  Top 0.2: v104.75,50.75 98,50.75 U1.8
  Bottom 0.2: 105.5,50 107.5,52 115.5,52 115.5,51 U3.8 | 105.5,50 104.75,49.25 104.75,27.25 103,25.5 U2.P7 | 105.5,50 v104.75,50.75
TMS9918_AD4-TMS4416_A3
  Top 0.2: U1.11 90.25,50.75 91.5,49.5 105.25,49.5 106.75,51 107.75,51 U3.11
  Bottom 0.2: U2.P6 105.5,25.5 105.75,25.75 105.75,48.75 107.75,50.75 U3.11
TMS9918_AD5-TMS4416_A2
  Top 0.2: U1.12 90.25,48.25 91.5,47 104.83,47 105.83,48 107,48 107.25,48.25 107.75,48.25 U3.12
  Bottom 0.2: U2.P5 108,25.5 109.25,26.75 109.25,47 108,48.25 U3.12
TMS9918_AD6-TMS4416_A1
  Top 0.2: U1.13 90.25,45.5 91.25,44.5 105.75,44.5 106.75,45.5 107.75,45.5 U3.13
  Bottom 0.2: U2.P4 110.25,25.5 109.75,26 109.75,48.25 108.5,49.5 107.25,49.5 107.25,49.25 106.75,48.75 106.75,46.75 107.75,45.75 U3.13
TMS9918_AD7-TMS4416_A0  (via drill 0.35)
  Top 0.2: U1.14 90.25,43 91.25,42 105.75,42 106.75,43 107.75,43 U3.14 | v106.75,30.5 108,30.5 113,25.5 U2.P3
  Bottom 0.2: v106.75,30.5 106.25,31 106.25,41.5 107.75,43 U3.14
TRIGGER
  Bottom 0.2: IC8.11 50.75,34.5 47.75,37.5 47.75,48.25 46.25,49.75 46.25,62.5 48.5,64.75 50.25,64.75 JOYSTICK1.6 50.5,65 50.5,66.25 59.25,66.25 64.75,60.75 64.75,60.5 69,60.5 71,58.5 RN1.9
TRIGGER1  (via drill 0.35)
  Top 0.2: v81,40.25 71.25,30.5 IC1.11
  Bottom 0.2: v81,40.25 86.25,45.5 86.25,58.25 RN1.3 86.25,58.5 84.75,60 JOYSTICK2.6
UP  (via drill 0.35)
  Top 0.2: v47.5,54.75 43.25,54.75 IC8.2 | v56.5,59.5 59.75,59.5 60.75,58.5 RN1.13
  Bottom 0.2: v47.5,54.75 48,55.25 48,59.5 | 48,59.5 48,61 49,62 JOYSTICK1.1 | 48,59.5 v56.5,59.5
UP1
  Top 0.2: JOYSTICK2.1 83.25,62 82.5,61.25 78.75,61.25 76,58.5 RN1.7
  Bottom 0.2: IC1.2 63.5,51 64.75,51 69.25,55.5 76,55.5 76,58.25 RN1.7
VCC  (via drill 0.35)
  Top 0.2: U$2.24 25.5,64.75 29,64.75 C6.1 | C12.1 16.75,21.75 20.25,25.25 27,25.25 29.5,27.75 36.75,27.75 U4.P16 | 118,53.5 C21.1 | REG1.P$3 133.25,35.75 132,37 122.75,37 122.25,37.5 122,37.5 C11.+ | 91.75,58 96.25,53.5 97.75,53.5 U1.9 | 91.75,58 91.5,58.25 RN1.1 91.75,58 | 91.75,58 91.5,58 88.5,55 76.5,55 75,53.5 C14.1 | C13.1 54.75,57 57,54.75 68.75,54.75 70,53.5 71,53.5 IC1.20 | v45,58.25 46.25,57 50.75,57 IC8.20
  Top 0.508: C21.1 U3.9
  Bottom 0.2: IC7.14 16.5,18 16.5,21.5 C12.1 | C20.1 38.25,11.5 38.25,15 U11.P16 38,15.25 38,21.25 37,22.25 37,27.75 U4.P16 36.75,28 36.75,33 C17.1 36.75,33.25 35.75,34.25 35.75,58.25 | 35.75,58.25 29.25,64.75 C6.1 | C16.1 103,6.5 103,10 U2.P34 102.75,10.25 100.5,10.25 U2.P33 100.25,10.25 99,11.5 99,25.75 99.5,26.25 99.5,53.5 | IC8.20 51,57.25 54.5,57.25 C13.1 | IC1.20 71.25,53.5 74.75,53.5 C14.1 | 99.5,53.5 98,53.5 U1.9 | 99.5,53.5 100.25,53.5 C15.1 | v45,58.25 35.75,58.25
  Bottom 0.508: Q2.C 129.69,26.82 129.69,28.4 133.35,32.06 REG1.P$3 | C11.+ 121.92,39.37 120.66,40.63 120.66,50.79 C21.1 117.31,54.14 117.31,54.73 116.98,55.06 101.08,55.06 100.64,54.61 100.33,54.61 C15.1
VDP-RD0
  Bottom 0.2: U2.P32 97.75,10.25 96.5,11.5 96.5,34.25 97.75,35.5 U1.2
VDP-RD1
  Bottom 0.2: U2.P31 95.25,10.25 94,11.5 94,26 96,28 96,36.25 97.75,38 U1.3
VDP-RD2
  Bottom 0.2: U2.P30 92.5,10 91.5,9 89,9 89,39.5 90,40.5 U1.15
VDP-RD3
  Bottom 0.2: U2.P29 90.25,10.25 91.5,11.5 91.5,34.25 90.25,35.5 U1.17
VDP-RD4  (via drill 0.35)
  Top 0.2: v105,13.25 90.75,13.25 87.75,10.25 U2.P28
  Bottom 0.2: v105,13.25 116.75,25 116.75,34.5 115.75,35.5 U3.2
VDP-RD5
  Top 0.2: U2.P27 85.25,10.25 99.06,24.06 99.06,27.94 100.33,29.21 101.6,29.21 103.14,30.75 106,30.75 106.5,31.25 109,31.25 115.75,38 U3.3
VDP-RD6  (via drill 0.35)
  Top 0.2: v107,36.75 101.5,31.25 96.5,31.25 96.5,24 82.75,10.25 U2.P26
  Bottom 0.2: v107,36.75 106.75,37 106.75,39.5 107.75,40.5 U3.15
VDP-RD7
  Bottom 0.2: U2.P25 80.25,10 85,5.25 104.25,5.25 104.25,22.5 106.75,25 106.75,29.5 107.5,30.25 107.5,31.75 106.75,32.5 106.75,34.5 107.75,35.5 U3.17
VOLTAGE-IN
  Bottom 0.508: REG1.P$1 134.16,41.45 J1.3 C5.+
XTAL1
  Bottom 0.2: Q1.1 124.25,5 118.25,5 C8.2 118.25,5.25 118.25,10 U2.P40
XTAL2
  Bottom 0.2: 124.5,11.5 124.5,15 C9.2 | 124.5,11.5 124.5,10.25 Q1.2 | 124.5,11.5 117,11.5 115.75,10.25 U2.P39